# EAGLE schematic justconnector (EAGLE 6.1)
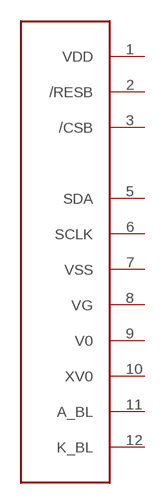
[diagram p0: schematic, sheet 1]

## Parts
U$1  PE9665WRFPE9665WRF  [PE9665WRF]
Unconnected: U$1.1(VDD) U$1.2(/RESB) U$1.3(/CSB) U$1.5(SDA) U$1.6(SCLK) U$1.7(VSS) U$1.8(VG) U$1.9(V0) U$1.10(XV0) U$1.11(A_BL) U$1.12(K_BL)

## Library data of the parts
U$1 = apus:PE9665WRF